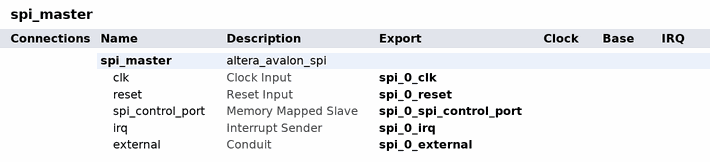
[diagram p0: system contents]
# Platform Designer (Qsys) system spi_master, Cyclone V 5CSXFC6D6F31C6
# Parameters at their usual value, and those the tool derives, are not listed.
package require -exact qsys 20.1
create_system spi_master
set_project_property DEVICE_FAMILY {Cyclone V}
set_project_property DEVICE 5CSXFC6D6F31C6

add_instance spi_master altera_avalon_spi 20.1
set_instance_parameter_value spi_master clockPolarity 0
set_instance_parameter_value spi_master dataWidth 8
set_instance_parameter_value spi_master masterSPI true
set_instance_parameter_value spi_master numberOfSlaves 1
set_instance_parameter_value spi_master targetClockRate 128000

# exported interfaces
add_interface spi_0_clk clock sink
set_interface_property spi_0_clk EXPORT_OF spi_master.clk
add_interface spi_0_external conduit end
set_interface_property spi_0_external EXPORT_OF spi_master.external
add_interface spi_0_irq interrupt sender
set_interface_property spi_0_irq EXPORT_OF spi_master.irq
add_interface spi_0_reset reset sink
set_interface_property spi_0_reset EXPORT_OF spi_master.reset
add_interface spi_0_spi_control_port avalon slave
set_interface_property spi_0_spi_control_port EXPORT_OF spi_master.spi_control_port

set_interconnect_requirement {$system} qsys_mm.clockCrossingAdapter HANDSHAKE
set_interconnect_requirement {$system} qsys_mm.enableEccProtection FALSE
set_interconnect_requirement {$system} qsys_mm.insertDefaultSlave FALSE
set_interconnect_requirement {$system} qsys_mm.maxAdditionalLatency 1

save_system spi_master.qsys
